# EAGLE design HW1_BeverlyYee_u0770041 (EAGLE 9.6.2)
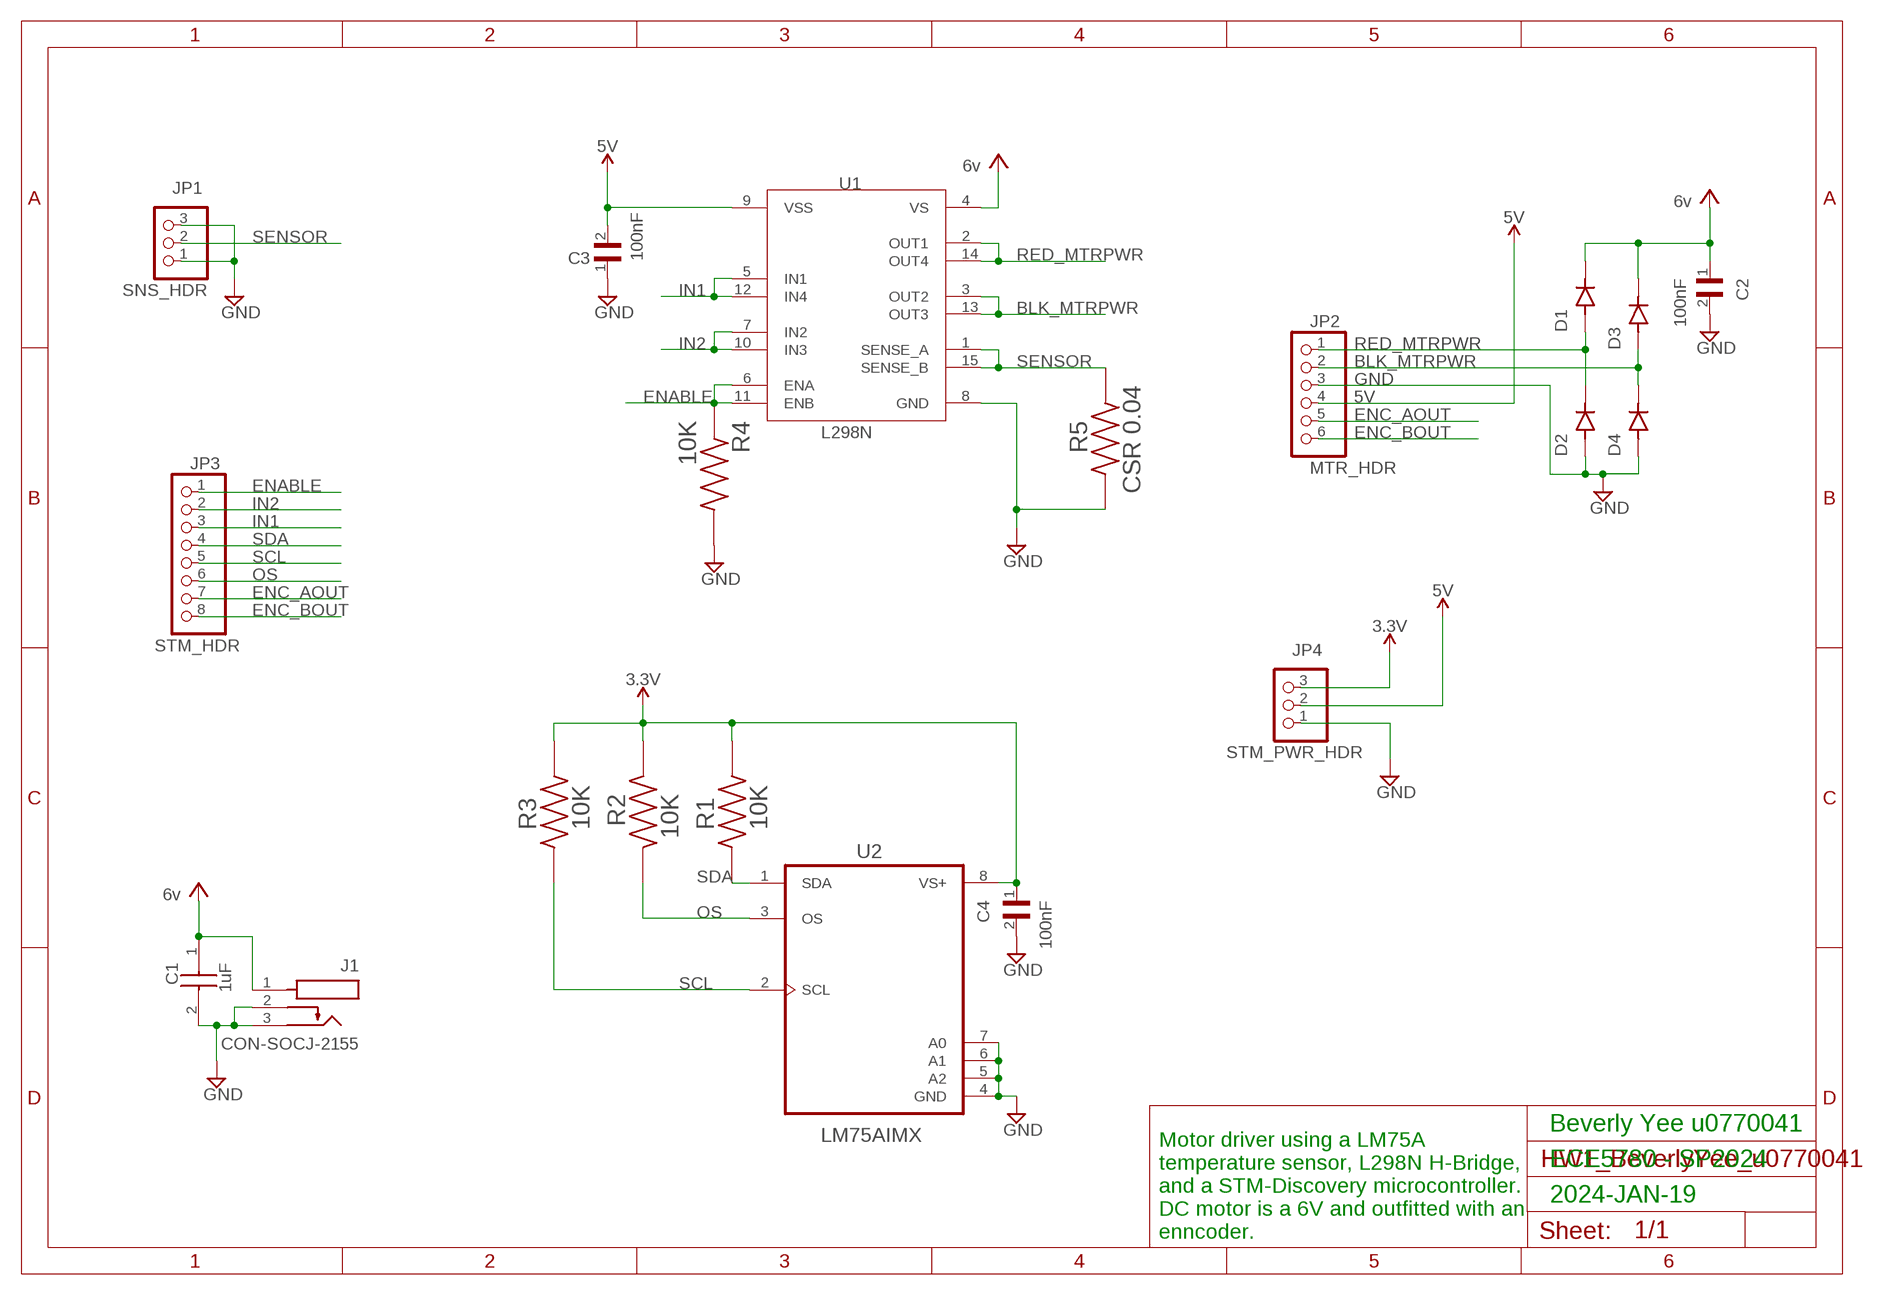
[diagram p0: schematic, sheet 1]

## Parts
C1  1uF  REA010M2CBK-0511P  [CAPPRD200W50D525H1250]
C2  100nF  C1206C104K5RAC7800  [CAPC3216X88N]
C3  100nF  C1206C104K5RAC7800  [CAPC3216X88N]
C4  100nF  C1206C104K5RAC7800  [CAPC3216X88N]
D1  RS2AA_R3G  [DIOM4325X250N]
D2  RS2AA_R3G  [DIOM4325X250N]
D3  RS2AA_R3G  [DIOM4325X250N]
D4  RS2AA_R3G  [DIOM4325X250N]
J1  CON-SOCJ-2155  [GRAVITECH_CON-SOCJ-2155]
JP1  SNS_HDR  PINHD-1X3  [1X03]
JP2  MTR_HDR  PINHD-1X6  [1X06]
JP3  STM_HDR  PINHD-1X8  [1X08]
JP4  STM_PWR_HDR  PINHD-1X3  [1X03]
R1  10K  RC1206JR-0710KL  [RESC3116X65N]
R2  10K  RC1206JR-0710KL  [RESC3116X65N]
R3  10K  RC1206JR-0710KL  [RESC3116X65N]
R4  10K  RC1206JR-0710KL  [RESC3116X65N]
R5  CSR 0.04  RL1206FR-070R04L  [RESC3116X65N]
U1  L298N  [TO127P2020X500X2100-15]
U2  LM75AIMX  LM75AIMX/NOPB  [SOIC127P599X175-8N]

## Nets
3.3V: C4.1 JP4.3 R1.2 R2.1 R3.2 U2.8(VS+)
5V: C3.2 JP2.4 JP4.2 U1.9(VSS)
BLK_MTRPWR: D3.A D4.C(K) JP2.2 U1.3(OUT2) U1.13(OUT3)
ENABLE: JP3.1 R4.1 U1.6(ENA) U1.11(ENB)
ENC_AOUT: JP2.5 JP3.7
ENC_BOUT: JP2.6 JP3.8
GND: C1.2(-) C2.2 C3.1 C4.2 D2.A D4.A J1.2 J1.3 JP1.1 JP1.3 JP2.3 JP4.1 R4.2 R5.2 U1.8(GND) U2.4(GND) U2.5(A2) U2.6(A1) U2.7(A0)
IN1: JP3.3 U1.5(IN1) U1.12(IN4)
IN2: JP3.2 U1.7(IN2) U1.10(IN3)
OS: JP3.6 R2.2 U2.3(OS)
RED_MTRPWR: D1.A D2.C(K) JP2.1 U1.2(OUT1) U1.14(OUT4)
SCL: JP3.5 R3.1 U2.2(SCL)
SDA: JP3.4 R1.1 U2.1(SDA)
SENSOR: JP1.2 R5.1 U1.1(SENSE_A) U1.15(SENSE_B)
VCC: C1.1(+) C2.1 D1.C(K) D3.C(K) J1.1 U1.4(VS)

## Notes on the sheet
- Motor driver using a LM75A 
  temperature sensor, L298N H-Bridge, 
  and a STM-Discovery microcontroller. 
  DC motor is a 6V and outfitted with an 
  enncoder.
- Beverly Yee u0770041
- ECE5780 - SP2024
- 2024-JAN-19

## Library data of the parts
C1 = REA010M2CBK-0511P:REA010M2CBK-0511P: Aluminum Electrolytic Capacitors - Radial Leaded 160V 1.0uF 20% 5x11mm Source: Datasheet <https://componentsearchengine.com/Datasheets/1/REA010M2CBK-0511P.pdf>; DESCRIPTION: Aluminum Electrolytic Capacitors - Radial Leaded 160V 1.0uF 20% 5x11mm; HEIGHT: 12.5mm; MANUFACTURER_NAME: Lelon; MANUFACTURER_PART_NUMBER: REA010M2CBK-0511P; MOUSER_PART_NUMBER: 140-REA1R0M2CBK0511P; MOUSER_PRICE-STOCK: https://www.mouser.co.uk/ProductDetail/Lelon/REA010M2CBK-0511P?qs=tsfqLUzc7IoVZpITlkTcwQ%3D%3D
C2-C4 = C1206C104K5RAC7800:C1206C104K5RAC7800: Cap Ceramic 0.1uF 50V X7R 10% SMD 1206 125C Plastic T/R; CHECK_PRICES: https://www.snapeda.com/parts/C1206C104K5RAC7800/KEMET/view-part/?ref=eda; DESCRIPTION: 0.1 µF ±10% 50V Ceramic Capacitor X7R 1206 (3216 Metric); DIGIKEY_PART_NUMBER: 399-C1206C104K5RAC7800TR-ND; MF: KEMET; MP: C1206C104K5RAC7800; PACKAGE: 3216 KEMET; PURCHASE-URL: https://www.snapeda.com/api/url_track_click_mouser/?unipart_id=3657871&manufacturer=KEMET&part_name=C1206C104K5RAC7800&search_term=c1206c104k5rac7800; SNAPEDA_LINK: https://www.snapeda.com/parts/C1206C104K5RAC7800/KEMET/view-part/?ref=snap
D1-D4 = RS2AA_R3G:RS2AA_R3G; CHECK_PRICES: https://www.snapeda.com/parts/RS2AA%20R3G/Taiwan+Semiconductor/view-part/?ref=eda; DESCRIPTION: Diode Standard 50 V 1.5A Surface Mount DO-214AC (SMA); DIGIKEY_PART_NUMBER: RS2AAR3GTR-ND; MF: Taiwan Semiconductor; MP: RS2AA R3G; PACKAGE: None; PURCHASE-URL: https://www.snapeda.com/api/url_track_click_mouser/?unipart_id=9675115&manufacturer=Taiwan Semiconductor&part_name=RS2AA R3G&search_term=rs2aa r3g; SNAPEDA_LINK: https://www.snapeda.com/parts/RS2AA%20R3G/Taiwan+Semiconductor/view-part/?ref=snap
J1 = CON-SOCJ-2155:CON-SOCJ-2155: DC Power Connectors Power Jack/Connector 2.1mm x 5.5mm Check availability <https://pricing.snapeda.com/parts/CON-SOCJ-2155/Gravitech/view-part?ref=eda>; AVAILABILITY: In Stock; CHECK_PRICES: https://www.snapeda.com/parts/CON-SOCJ-2155/Gravitech/view-part/?ref=eda; DESCRIPTION: DC Power Connectors Power Jack/Connector 2.1mm x 5.5mm; MF: Gravitech; MP: CON-SOCJ-2155; PACKAGE: None; PRICE: None; SNAPEDA_LINK: https://www.snapeda.com/parts/CON-SOCJ-2155/Gravitech/view-part/?ref=snap
JP1 JP4 = pinhead:PINHD-1X3: PIN HEADER
JP2 = pinhead:PINHD-1X6: PIN HEADER
JP3 = pinhead:PINHD-1X8: PIN HEADER
R1-R4 = RC1206JR-0710KL:RC1206JR-0710KL: Res Thick Film 1206 10K Ohm 5% 0.25W(1/4W) ±100ppm/C Epoxy Pad SMD T/R; CHECK_PRICES: https://www.snapeda.com/parts/RC1206JR-0710KL/Yageo/view-part/?ref=eda; DESCRIPTION: 10 kOhms ±5% 0.25W, 1/4W Chip Resistor 1206 (3216 Metric) Moisture Resistant Thick Film; DIGIKEY_PART_NUMBER: 311-10KERTR-ND; MF: Yageo; MP: RC1206JR-0710KL; PACKAGE: 3116 Yageo; PURCHASE-URL: https://www.snapeda.com/api/url_track_click_mouser/?unipart_id=280107&manufacturer=Yageo&part_name=RC1206JR-0710KL&search_term=rc1206jr-0710kl; SNAPEDA_LINK: https://www.snapeda.com/parts/RC1206JR-0710KL/Yageo/view-part/?ref=snap
R5 = RL1206FR-070R04L:RL1206FR-070R04L; CHECK_PRICES: https://www.snapeda.com/parts/RL1206FR-070R04L/Yageo/view-part/?ref=eda; DESCRIPTION: 40 mOhms ±1% 0.25W, 1/4W Chip Resistor 1206 (3216 Metric) Automotive AEC-Q200, Current Sense, Moisture Resistant Thick Film; DIGIKEY_PART_NUMBER: 311-.04LWTR-ND; MF: Yageo; MP: RL1206FR-070R04L; PACKAGE: 3116 Yageo; PURCHASE-URL: https://www.snapeda.com/api/url_track_click_mouser/?unipart_id=3600450&manufacturer=Yageo&part_name=RL1206FR-070R04L&search_term=rl1206fr-070r04l; SNAPEDA_LINK: https://www.snapeda.com/parts/RL1206FR-070R04L/Yageo/view-part/?ref=snap
U1 = L298N:L298N: Dual Full Bridge Motor Driver 15-Pin(15+Tab) MULTIWATT V Tube Check availability <https://pricing.snapeda.com/parts/L298N/STMicroelectronics/view-part?ref=eda>; AVAILABILITY: In Stock; CHECK_PRICES: https://www.snapeda.com/parts/L298N/STMicroelectronics/view-part/?ref=eda; DESCRIPTION: Half Bridge (4) Driver DC Motors, Relays, Solenoids, Stepper Motors Bipolar 15-Multiwatt; MF: STMicroelectronics; MP: L298N; PACKAGE: Multiwatt-15 STMicroelectronics; PRICE: None; PURCHASE-URL: https://www.snapeda.com/api/url_track_click_mouser/?unipart_id=49315&manufacturer=STMicroelectronics&part_name=L298N&search_term=l298n; SNAPEDA_LINK: https://www.snapeda.com/parts/L298N/STMicroelectronics/view-part/?ref=snap
U2 = LM75AIMX_NOPB:LM75AIMX/NOPB: Check availability <https://pricing.snapeda.com/parts/LM75AIMX/NOPB/Texas%20Instruments/view-part?ref=eda>; AVAILABILITY: In Stock; CHECK_PRICES: https://www.snapeda.com/parts/LM75AIMX/NOPB/Texas+Instruments/view-part/?ref=eda; COMPONENT: TMP_SNSR; DESCRIPTION: 2C industry standard temperature sensor, I2C/SMBus interface; MF: Texas Instruments; MP: LM75AIMX/NOPB; PACKAGE: SOIC-8 Texas Instruments; PRICE: None; PURCHASE-URL: https://www.snapeda.com/api/url_track_click_mouser/?unipart_id=1214383&manufacturer=Texas Instruments&part_name=LM75AIMX/NOPB&search_term=lm75aimx/nopb; SNAPEDA_LINK: https://www.snapeda.com/parts/LM75AIMX/NOPB/Texas+Instruments/view-part/?ref=snap

## Board
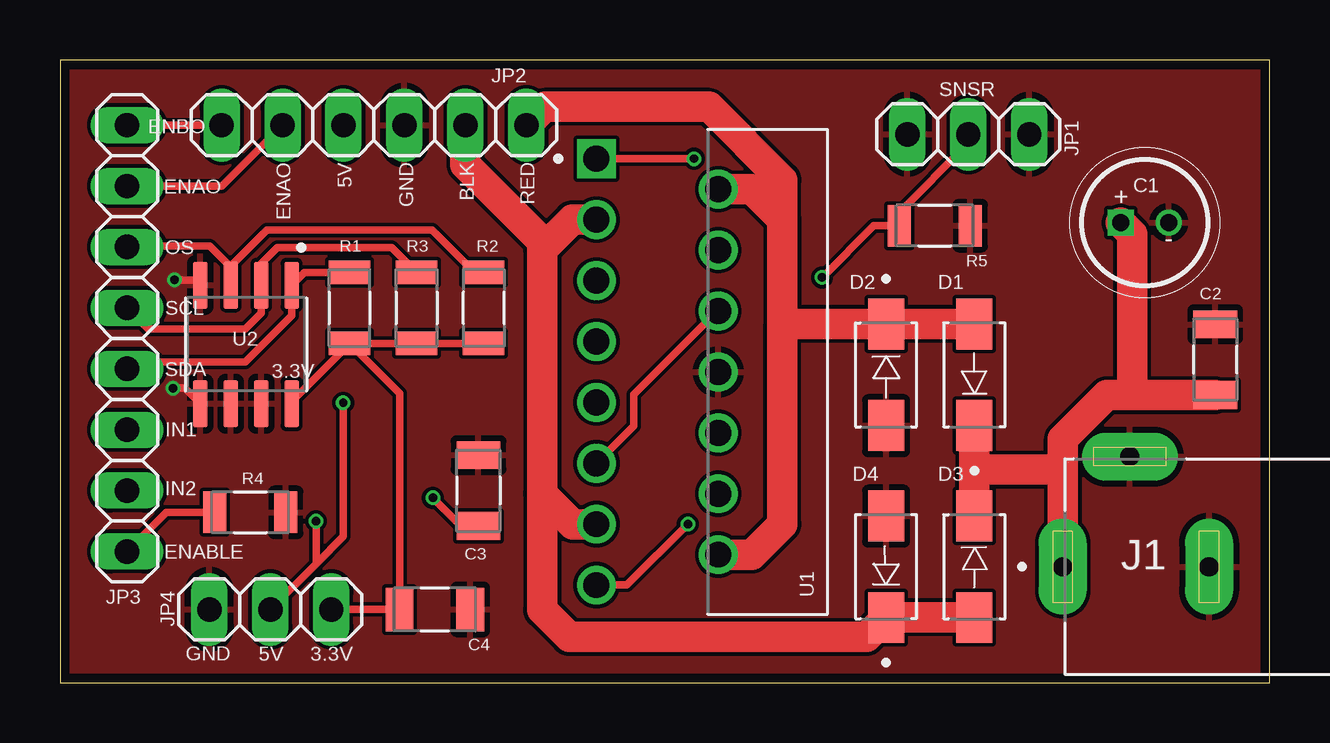
[diagram p1: board, top side]
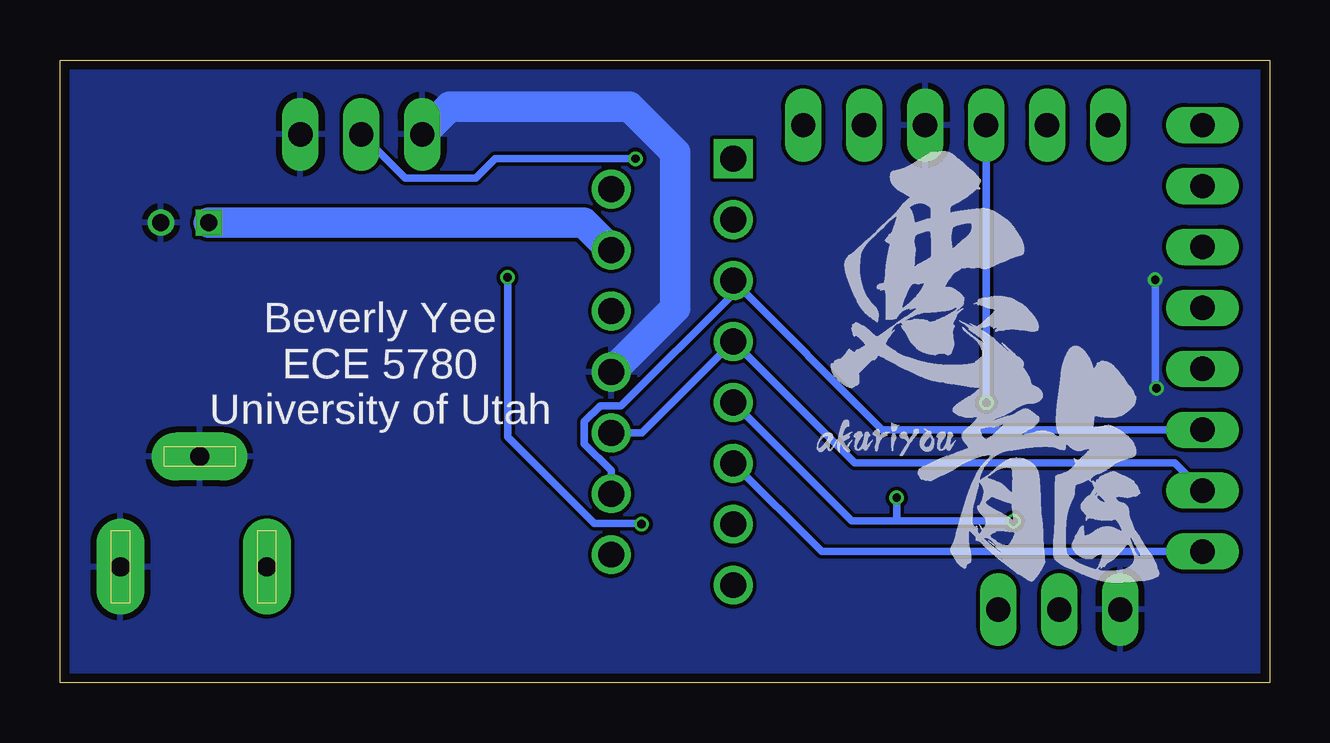
[diagram p2: board, bottom side, seen from below]

Size 50.4 x 25.96 mm. Coordinates in mm from the lower left corner, seen from the top.
Outline: 0,0 50.4,0 50.4,25.96 0,25.96 0,0
Copper layers (1*16): Top 0.035559375mm / dielectric 1.6mm / Bottom 0.035559375mm
Design rules "oshpark-2layer": minimum track width 6mil, minimum drill 10mil, track to track 6mil, track to pad 6mil, pad to pad 6mil, via to via 6mil, smd to smd 6mil, copper to edge 15mil, drill to drill 6mil, minimum pad ring 5mil, minimum via ring 5mil, stop-mask expansion 2.5mil, vias tented up to drill 0mil, thermal gap 10mil

### Footprints (pad centres in the part's own frame; a part is rotated, then mirrored left to right if it is on the bottom)
CAPPRD200W50D525H1250 = drill 0.7 pad 1.1 square: 1 0,0 | drill 0.7 pad 1.1: 2 2,0
CAPC3216X88N = smd 1.16 x 1.82: 1 -1.475,0; 2 1.475,0
DIOM4325X250N = smd 2.12 x 1.5: A 2.115,0; C -2.115,0
GRAVITECH_CON-SOCJ-2155 = drill 0.8 pad 2 long: 1 6.1,0; 2 3.3,-4.6; 3 0,0
1X03 = drill 1.016 long: 1 -2.54,0; 2 0,0; 3 2.54,0
1X06 = drill 1.016 long: 1 -6.35,0; 2 -3.81,0; 3 -1.27,0; 4 1.27,0; 5 3.81,0; 6 6.35,0
1X08 = drill 1.016 long: 1 -8.89,0; 2 -6.35,0; 3 -3.81,0; 4 -1.27,0; 5 1.27,0; 6 3.81,0; 7 6.35,0; 8 8.89,0
RESC3116X65N = smd 0.97 x 1.73: 1 -1.48,0; 2 1.48,0
TO127P2020X500X2100-15 = drill 1.08 pad 1.62 square: 1 0,0 | drill 1.08 pad 1.62: 2 5.08,-1.27; 3 0,-2.54; 4 5.08,-3.81; 5 0,-5.08; 6 5.08,-6.35; 7 0,-7.62; 8 5.08,-8.89; 9 0,-10.16; 10 5.08,-11.43; 11 0,-12.7; 12 5.08,-13.97; 13 0,-15.24; 14 5.08,-16.51; 15 0,-17.78
SOIC127P599X175-8N = smd 1.97 x 0.6: 1 -2.47,1.905; 2 -2.47,0.635; 3 -2.47,-0.635; 4 -2.47,-1.905; 5 2.47,-1.905; 6 2.47,-0.635; 7 2.47,0.635; 8 2.47,1.905

### Placement (x,y rotation side)
C1  44.2,19.18 0 top
C2  48.13,13.46 90 top
C3  17.43,8.01 270 top
C4  15.62,3.05 0 top
D1  38.1,12.83 90 top
D2  34.42,12.83 270 top
D3  38.1,4.83 270 top
D4  34.42,4.83 90 top
J1  47.88,4.83 180 top
JP1  37.85,22.86 180 top
JP2  13.08,23.24 180 top
JP3  2.79,14.35 90 top
JP4  8.76,3.05 0 top
R1  12.06,15.62 270 top
R2  17.65,15.62 90 top
R3  14.86,15.62 270 top
R4  7.93,7.1 0 top
R5  36.45,19.05 0 top
U1  22.35,21.84 0 top
U2  7.75,14.1 270 top

### Tracks (layer width: path | path; a pad name or v marks a point on that pad's centre or on a via)
3.3V
  Top 0.305: R1.2 R3.2 R2.1 | U2.8 9.65,11.73 R1.2 | R1.2 | R1.2 14.15,12.06 C4.1 JP4.3
5V  (via drill 0.35)
  Top 0.305: JP4.2 10.67,4.95 | 10.67,4.95 v10.67,6.73 | v11.8,11.66 11.8,6.09 10.67,4.95 | C3.2 16.7,6.53 v15.53,7.7
  Bottom 0.305: v10.67,6.73 15.51,6.73 | 15.51,6.73 17.4,6.73 U1.9 | v15.53,7.7 15.53,6.75 15.51,6.73 | v11.8,11.66 11.8,23.23 JP2.4
BLK_MTRPWR
  Top 1.27: D3.A D4.C 33.61,1.91 21.21,1.91 20.09,3.02 20.09,7.87 | U1.3 21.34,19.3 20.09,18.06 | 20.09,18.06 20.09,18.44 20.07,18.41 16.89,21.59 JP2.2 | 20.09,18.06 20.09,7.87 | U1.13 21.36,6.6 20.09,7.87
ENABLE
  Top 0.305: JP3.1 4.43,7.1 R4.1 | U1.11 23.9,10.7 23.9,12.02 27.38,15.49 U1.6
  Bottom 0.305: U1.11 18.67,5.46 JP3.1
ENC_AOUT
  Top 0.305: JP3.7 6.73,20.7 JP2.5
ENC_BOUT
  Top 0.305: JP3.8 JP2.6
GND  (via drill 0.35)
  Top 0.305: v4.77,16.78 5.62,16.78 U2.4 | v4.7,12.27 5.2,12.27 U2.5
  Bottom 0.305: v4.77,16.78 4.77,12.33 v4.7,12.27
  Bottom 1.27: U1.8 24.77,15.62 24.77,22.1 26.67,24 34.16,24 JP1.3
  pour Bottom: -0.25,26.16 50.67,26.16 50.67,-0.25 -0.25,-0.25
  pour Top: -0.25,26.16 50.67,26.16 50.67,-0.25 -0.25,-0.25
IN1
  Bottom 0.305: JP3.3 16.13,10.54 U1.5 22.35,16.2 27.03,11.53 27.89,11.53 28.55,10.88 28.55,9.95 27.43,8.84 U1.12
IN2
  Bottom 0.305: JP3.2 3.95,9.16 17.29,9.16 U1.7 26.16,10.41 U1.10
OS
  Top 0.305: R2.2 17.27,17.1 15.52,18.86 8.61,18.86 7.1,17.34 7.1,16.58 U2.3 7.11,17.33 6.24,18.2 2.83,18.2 JP3.6
RED_MTRPWR
  Top 1.27: D1.A D2.C 30.1,14.94 | U1.2 28.83,20.57 30.1,19.3 | U1.14 28.83,5.33 30.1,6.6 30.1,14.94 | JP2.1 20.19,24 27.05,24 30.1,20.95 30.1,19.3 | 30.1,19.3 30.1,14.94
SCL
  Top 0.305: JP3.5 3.68,14.73 7.71,14.73 8.38,15.4 U2.2 8.38,17.48 9.05,18.15 13.82,18.15 R3.1
SDA
  Top 0.305: JP3.4 3.09,13.37 7.73,13.37 9.65,15.3 U2.1 10.19,17.1 R1.1
SENSOR  (via drill 0.35)
  Top 0.305: JP1.2 37.89,22.86 38.06,22.69 34.69,19.33 R5.1 33.91,19.05 v31.75,16.89 | U1.1 v26.42,21.84 | v26.16,6.6 23.62,4.06 U1.15
  Bottom 0.305: v26.42,21.84 32.27,21.84 33.09,21.03 36.02,21.03 JP1.2 | v26.16,6.6 26.19,6.63 28.15,6.63 31.75,10.23 v31.75,16.89
VCC
  Top 1.27: D3.C 38.1,8.82 | J1.1 41.79,4.84 41.79,8.88 | 41.79,8.88 41.79,10.17 43.61,11.99 44.67,11.99 | 38.1,8.82 38.16,8.88 41.79,8.88 | 44.67,11.99 C2.1 | 44.67,11.99 44.67,18.7 C1.1 | D1.C 38.1,8.82
  Bottom 1.27: C1.1 28.57,19.18 U1.4

### Text on the board
tPlace: SNSR | ENBO | RED | ENAO | 5V | GND | BLK | ENAO | + | OS | - | SCL | SDA | 3.3V | IN1 | IN2 | ENABLE | GND | 5V | 3.3V
bPlace: Beverly Yee / ECE 5780 / University of Utah